# Altium schematic sheet Inputs.SchDoc
size A4; SheetNumber: 1; SheetTotal: 4
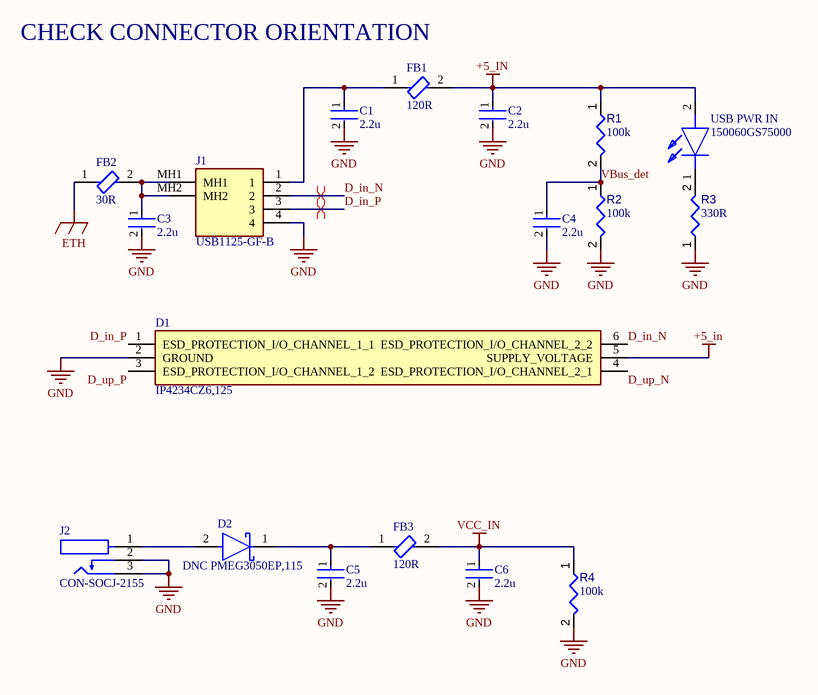
[diagram p0: Inputs.SchDoc]

## Parts
C1  Capacitance: 2.2u  [0603-C]  (hidden comment: 0603 CAP)
C2  Capacitance: 2.2u  [0603-C]  (hidden comment: 0603 CAP)
C3  Capacitance: 2.2u  [0603-C]  (hidden comment: 0603 CAP)
C4  Capacitance: 2.2u  [0603-C]  (hidden comment: 0603 CAP)
C5  Capacitance: 2.2u  [0603-C]  (hidden comment: 0603 CAP)
C6  Capacitance: 2.2u  [0603-C]  (hidden comment: 0603 CAP)
D1  IP4234CZ6,125  [SOP95P275X110-6N]
D2  DNC PMEG3050EP,115  [FP-SOD128-MFG]
FB1  120R  [FP-ILHB-0805-IPC_C]
FB2  30R  [FP-BLM18-0_15-t0_6-d1_2-MFG]
FB3  120R  [FP-ILHB-0805-IPC_C]
J1  USB1125-GF-B  [USB1125GFB]
J2  CON-SOCJ-2155  [GRAVITECH_CON-SOCJ-2155]
R1  value 100k  [0603-R]  (hidden comment: 0603 Resistor)
R2  value 100k  [0603-R]  (hidden comment: 0603 Resistor)
R3  value 330R  [0603-R]  (hidden comment: 0603 Resistor)
R4  value 100k  [0603-R]  (hidden comment: 0603 Resistor)
USB_PWR_IN  150060GS75000  [LEDC1608X80N]

## Nets
+5_in: C2.1 D1.5(SUPPLY_VOLTAGE) FB1.2 R1.1 USB_PWR_IN.2(A)
ETH: FB2.1
GND: C1.2 C2.2 C3.2 C4.2 C5.2 C6.2 D1.2(GROUND) J1.4 J2.2 J2.3 R2.2 R3.1 R4.2
VCC_IN: C6.1 FB3.2 R4.1
D_in_N: D1.6(ESD_PROTECTION_I/O_CHANNEL_2_2) J1.2
D_in_P: D1.1(ESD_PROTECTION_I/O_CHANNEL_1_1) J1.3
D_up_N: D1.4(ESD_PROTECTION_I/O_CHANNEL_2_1)
D_up_P: D1.3(ESD_PROTECTION_I/O_CHANNEL_1_2)
VBus_det: C4.1 R1.2 R2.1
NetC1_1: C1.1 FB1.1 J1.1
NetC3_1: C3.1 FB2.2 J1.MH1 J1.MH2
NetC5_1: C5.1 D2.1(C) FB3.1
NetD2_2: D2.2(A) J2.1
NetR3_2: R3.2 USB_PWR_IN.1(K)

## Layout directives
differential pair: D_in_N, D_in_P

## Notes on the sheet
- CHECK CONNECTOR ORIENTATION

## Library data of the parts
C1-C6 = CMP-2006-02792-2: Manufacturer: Murata; Manufacturer Part Number: GRM188R60J106ME47D; Voltage Rating (DC): 6.3V; Dielectric: X5R; Material: Ceramic; Tolerance: 20%; Packaging: Tape and Reel; Width: 0.031inch; Termination: SMD/SMT; Package Quantity: 4000; Voltage Rating: 6.3V; Case/Package: 0603; Min Operating Temperature: -55°C; Voltage: 6.3V; Length: 1.6mm; Thickness: 0.035inch; Lead Free: Lead Free; Depth: 0.8mm; Case Code (Imperial): 0603; Max Operating Temperature: 85°C; Height: 0.8mm; Mount: Surface Mount; REACH SVHC: No SVHC; Radiation Hardening: No; Case Code (Metric): 1608
D1 = IP4234CZ6,125: Diode; Manufacturer_Name: Nexperia; Datasheet Link: https://assets.nexperia.com/documents/data-sheet/IP4234CZ6.pdf; Height: 1.1mm; Manufacturer_Part_Number: IP4234CZ6,125; Mouser Part Number: 771-IP4234CZ6125; Mouser Price/Stock: https://www.mouser.co.uk/ProductDetail/Nexperia/IP4234CZ6125?qs=sSXnapcmqSskfgXn%2F9aKzA%3D%3D; Arrow Part Number: IP4234CZ6,125; Arrow Price/Stock: https://www.arrow.com/en/products/ip4234cz6125/nexperia?region=nac
D2 = CMP-14398-000051-1: DIODE SCHOTTKY 30V 5A SOD128; RoHS Compliant: Yes
FB1 FB3 = CMP-02428-000001-1: FERRITE BEAD 600 OHM 0805 1LN; Manufacturer: Vishay; Manufacturer Part Number: ILHB0805ER601V; Tolerance: 25%; Shielding: true; Test Frequency: 100MHz; Impedance At Frequency: 600Ω @ 100MHz; Series Resistance: 0.1Ω; Rms Current: 2000mA; ComponentLink2URL: http://www.vishay.com/docs/34102/ilhb.pdf; Octopart: https://octopart.com/ilhb0805er601v-vishay-39650184; Automotive: No; Height: 1.1mm; Mouser Description: Ferrite Beads Multi-Layer High Current 600Ohm 25% 100MHz 2A 100mOhm DCR 0805 T/R; ComponentLink2Description: Datasheet; Device Class L2: EMI / RFI Components; Lead Free: Yes; Ipc Land Pattern Name: CAPC200125X90; Package: ILHB-0805; Device Class L1: Passive Components; Digikey Description: FERRITE BEAD 600 OHM 0805 1LN; Category: FBead; Temperature Range High: +125°C; Temperature: -55°C to +125°C; RoHS: TRUE; Temperature Range Low: -55°C; Device Class L3: Ferrite Beads and Chips
FB2 = CMP-0686-00540-4: Chip Ferrite Bead Array, 0603, 30Ω @ 100MHz, 25%, 0.01Ω, 5A; Material: Steel; Number of Circuits: 1; DC Resistance (DCR): 10mR; Max Operating Temperature: 125°C; Max DC Current: 5A; Lead Free: Lead Free; Case Code (Imperial): 0603; RoHS Compliant: Yes; DC Current: 5A; Series: BLM18K; Number of Pins: 2; REACH SVHC: No SVHC; Case/Package: 0603; Military Standard: Not; Height: 0.8mm; Depth: 0.8mm; Core Material: Ferrite; Length: 1.6mm; Weight: 7.1E-05oz; Case Code (Metric): 1608; Impedance: 30R; Termination: SMD/SMT; Tolerance: 25%; Number of Lines: 1; Radiation Hardening: No; Packaging: Tape and Reel; Test Frequency: 100MHz; Current Rating: 5A; Package Quantity: 1; Width: 0.8mm; Max Current Rating: 5A; Min Operating Temperature: -55°C
J1 = USB1125-GF-B: Connector; Manufacturer_Name: GCT (GLOBAL CONNECTOR TECHNOLOGY); Datasheet Link: https://gct.co/connector/usb1125; Height: 6.63mm; Manufacturer_Part_Number: USB1125-GF-B; Mouser Part Number: 640-USB1125-GF-B; Mouser Price/Stock: https://www.mouser.co.uk/ProductDetail/GCT/USB1125-GF-B?qs=KUoIvG%2F9IlbMrLtAEIp0gA%3D%3D
J2 = CON-SOCJ-2155: DC Power Connectors Power Jack/Connector 2.1mm x 5.5mm; Price: None; Package: None; Availability: Unavailable; MP: CON-SOCJ-2155; Value: *
R1-R4 = CMP-009-00014-5: Manufacturer: Yageo; Manufacturer Part Number: RC0603FR-071KL; Manufacturer: Panasonic; Manufacturer Part Number: ERJ3EKF1001V; Manufacturer Part Number: RC0603FR-131KL; Voltage Rating: 50V; Power: 100mW; Tolerance: 1%; Mounting Technology: SM; Pins: 2; Case/Package: 0603; Min Operating Temperature: -55°C; RoHS Compliant: True; Max Operating Temperature: 155°C; Component Type: Resistors
USB_PWR_IN = 150060GS75000: LED; Manufacturer_Name: Wurth Elektronik; Datasheet Link: https://componentsearchengine.com/Datasheets/2/150060GS75000.pdf; Height: 0.8mm; Manufacturer_Part_Number: 150060GS75000; Mouser Part Number: 710-150060GS75000; Mouser Price/Stock: https://www.mouser.co.uk/ProductDetail/Wurth-Elektronik/150060GS75000?qs=LlUlMxKIyB0UYkq5lDO8nA%3D%3D